# EAGLE design DUCO Miner 5D (EAGLE 9.6.2)
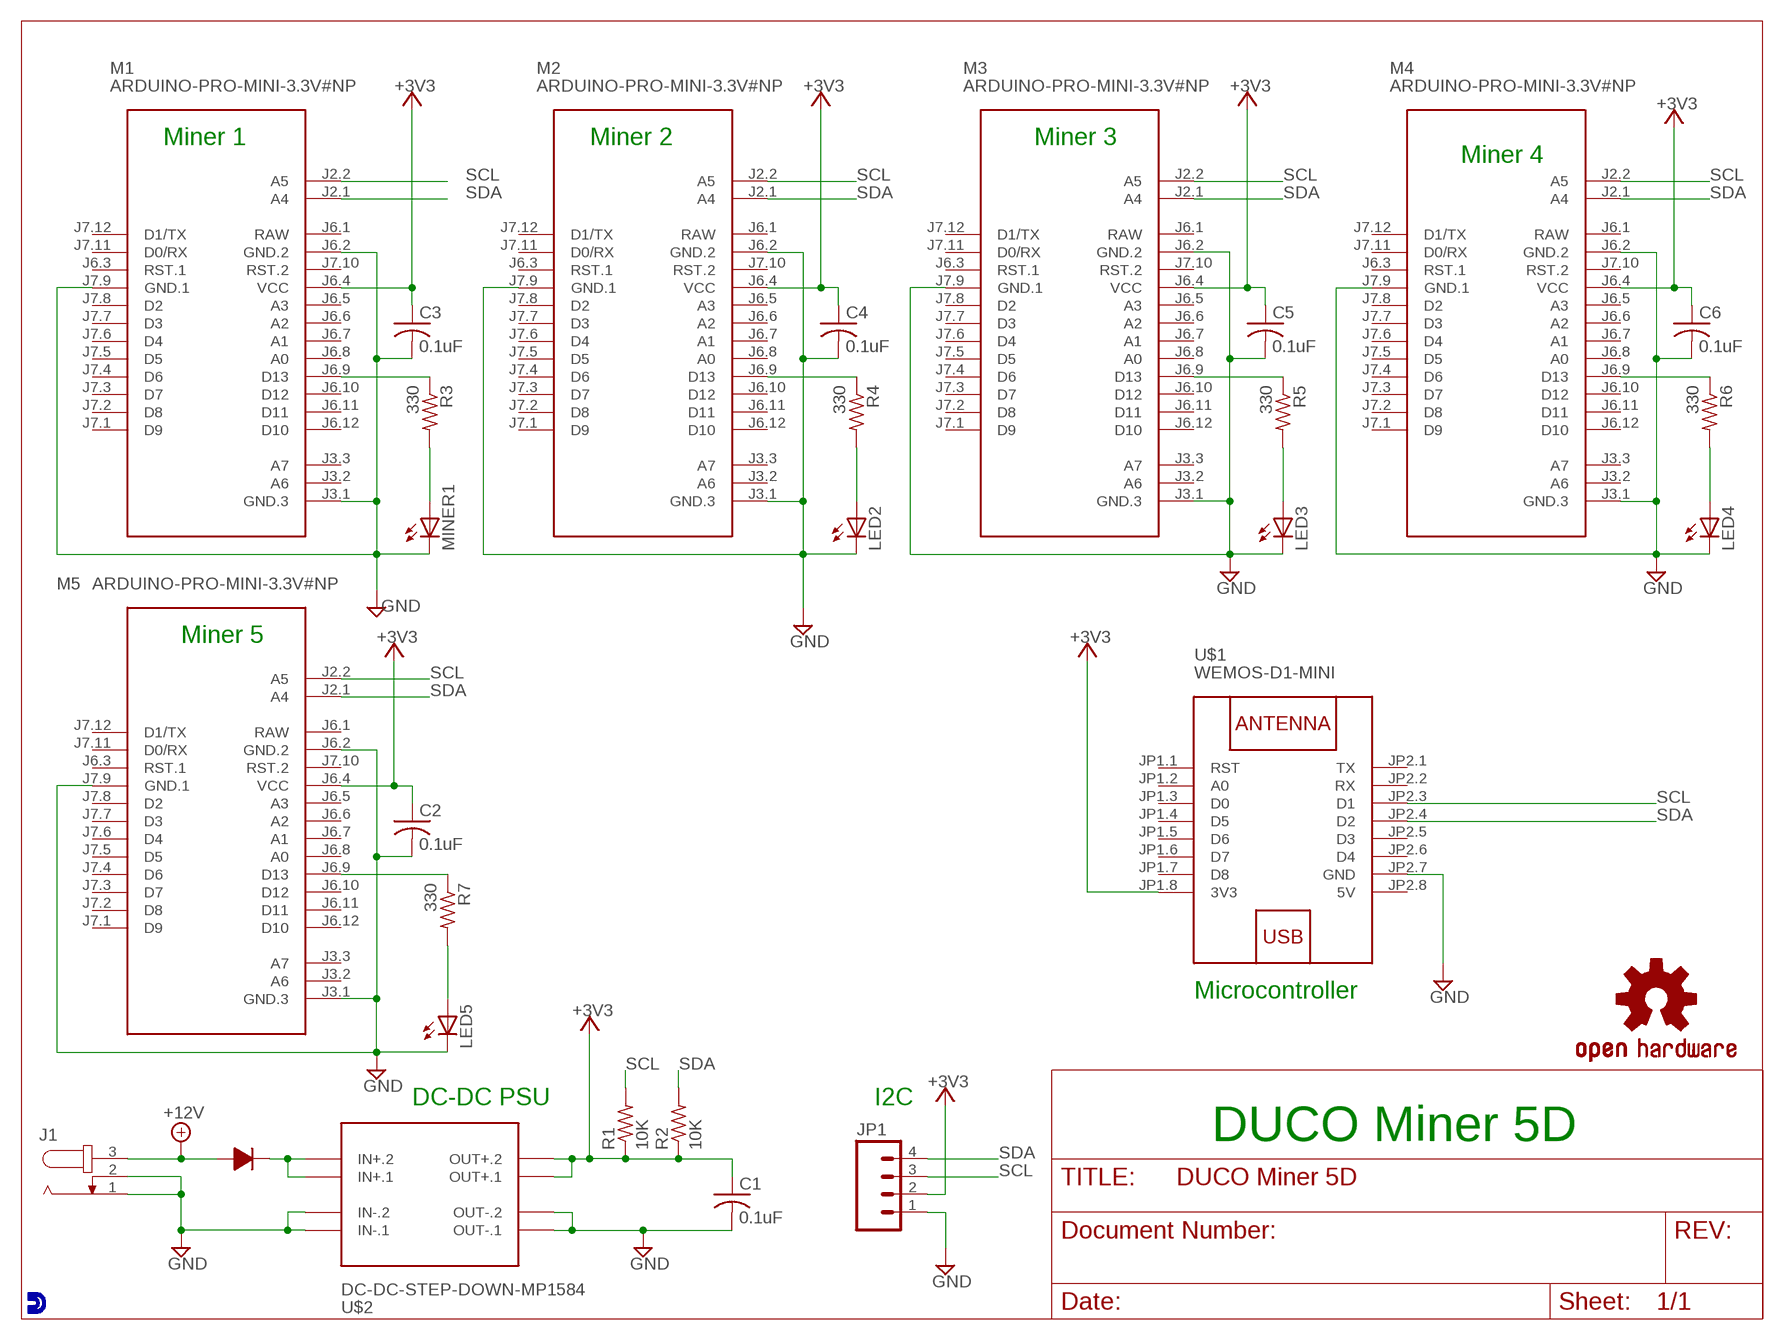
[diagram p0: schematic, sheet 1]

## Parts
C1  0.1uF  C-US025-025X050  [C025-025X050]
C2  0.1uF  C-US025-025X050  [C025-025X050]
C3  0.1uF  C-US025-025X050  [C025-025X050]
C4  0.1uF  C-US025-025X050  [C025-025X050]
C5  0.1uF  C-US025-025X050  [C025-025X050]
C6  0.1uF  C-US025-025X050  [C025-025X050]
J1  JACK-PLUG1  [SPC4078]
JP1  M04PTH  [1X04]
LED2  LED3MM  [LED3MM]
LED3  LED3MM  [LED3MM]
LED4  LED3MM  [LED3MM]
LED5  LED3MM  [LED3MM]
LOGO1  OSHW-LOGOS  [OSHW-LOGO-S]
M1  ARDUINO-PRO-MINI-3.3V#NP  [ARDUINO-PRO-MINI#NP]
M2  ARDUINO-PRO-MINI-3.3V#NP  [ARDUINO-PRO-MINI#NP]
M3  ARDUINO-PRO-MINI-3.3V#NP  [ARDUINO-PRO-MINI#NP]
M4  ARDUINO-PRO-MINI-3.3V#NP  [ARDUINO-PRO-MINI#NP]
M5  ARDUINO-PRO-MINI-3.3V#NP  [ARDUINO-PRO-MINI#NP]
MINER1  LED3MM  [LED3MM]
R1  10K  R-US_0204/7  [0204/7]
R2  10K  R-US_0204/7  [0204/7]
R3  330  R-US_0204/7  [0204/7]
R4  330  R-US_0204/7  [0204/7]
R5  330  R-US_0204/7  [0204/7]
R6  330  R-US_0204/7  [0204/7]
R7  330  R-US_0204/7  [0204/7]
U$1  WEMOS-D1-MINI  [WEMOS-D1-MINI]
U$2  DC-DC-STEP-DOWN-MP1584  [DC-DC-STEP-DOWN-MP1584]
U$4  1N4001  [DIODE-12.70]

## Nets
+3V3: C1.1 C2.1 C3.1 C4.1 C5.1 C6.1 JP1.2 M1.J6.4(VCC) M2.J6.4(VCC) M3.J6.4(VCC) M4.J6.4(VCC) M5.J6.4(VCC) R1.1 R2.1 U$1.JP1.8(3V3) U$2.OUT+.1 U$2.OUT+.2
+12V: J1.3 U$4.P$1
GND: C1.2 C2.2 C3.2 C4.2 C5.2 C6.2 J1.1 J1.2 JP1.1 LED2.K(C) LED3.K(C) LED4.K(C) LED5.K(C) M1.J3.1(GND.3) M1.J6.2(GND.2) M1.J7.9(GND.1) M2.J3.1(GND.3) M2.J6.2(GND.2) M2.J7.9(GND.1) M3.J3.1(GND.3) M3.J6.2(GND.2) M3.J7.9(GND.1) M4.J3.1(GND.3) M4.J6.2(GND.2) M4.J7.9(GND.1) M5.J3.1(GND.3) M5.J6.2(GND.2) M5.J7.9(GND.1) MINER1.K(C) U$1.JP2.7(GND) U$2.IN-.1 U$2.IN-.2 U$2.OUT-.1 U$2.OUT-.2
N$2: U$2.IN+.1 U$2.IN+.2 U$4.P$2
N$3: M1.J6.9(D13) R3.1
N$4: MINER1.A R3.2
N$5: M2.J6.9(D13) R4.1
N$6: LED2.A R4.2
N$7: M3.J6.9(D13) R5.1
N$8: LED3.A R5.2
N$9: M4.J6.9(D13) R6.1
N$10: LED4.A R6.2
N$11: M5.J6.9(D13) R7.1
N$13: LED5.A R7.2
SCL: JP1.3 M1.J2.2(A5) M2.J2.2(A5) M3.J2.2(A5) M4.J2.2(A5) M5.J2.2(A5) R1.2 U$1.JP2.3(D1)
SDA: JP1.4 M1.J2.1(A4) M2.J2.1(A4) M3.J2.1(A4) M4.J2.1(A4) M5.J2.1(A4) R2.2 U$1.JP2.4(D2)
Unconnected: M1.J3.2(A6) M1.J3.3(A7) M1.J6.3(RST.1) M1.J6.5(A3) M1.J6.6(A2) M1.J6.7(A1) M1.J6.8(A0) M1.J6.10(D12) M1.J6.11(D11) M1.J6.12(D10) M1.J7.1(D9) M1.J7.2(D8) M1.J7.3(D7) M1.J7.4(D6) M1.J7.5(D5) M1.J7.6(D4) M1.J7.7(D3) M1.J7.8(D2) M1.J7.10(RST.2) M1.J7.11(D0/RX) M1.J7.12(D1/TX) M2.J3.2(A6) M2.J3.3(A7) M2.J6.3(RST.1) M2.J6.5(A3) M2.J6.6(A2) M2.J6.7(A1) M2.J6.8(A0) M2.J6.10(D12) M2.J6.11(D11) M2.J6.12(D10) M2.J7.1(D9) M2.J7.2(D8) M2.J7.3(D7) M2.J7.4(D6) M2.J7.5(D5) M2.J7.6(D4) M2.J7.7(D3) M2.J7.8(D2) M2.J7.10(RST.2) M2.J7.11(D0/RX) M2.J7.12(D1/TX) M3.J3.2(A6) M3.J3.3(A7) M3.J6.3(RST.1) M3.J6.5(A3) M3.J6.6(A2) M3.J6.7(A1) M3.J6.8(A0) M3.J6.10(D12) M3.J6.11(D11) M3.J6.12(D10) M3.J7.1(D9) M3.J7.2(D8) M3.J7.3(D7) M3.J7.4(D6) M3.J7.5(D5) M3.J7.6(D4) M3.J7.7(D3) M3.J7.8(D2) M3.J7.10(RST.2) M3.J7.11(D0/RX) M3.J7.12(D1/TX) M4.J3.2(A6) M4.J3.3(A7) M4.J6.3(RST.1) M4.J6.5(A3) M4.J6.6(A2) M4.J6.7(A1) M4.J6.8(A0) M4.J6.10(D12) M4.J6.11(D11) M4.J6.12(D10) M4.J7.1(D9) M4.J7.2(D8) M4.J7.3(D7) M4.J7.4(D6) M4.J7.5(D5) M4.J7.6(D4) M4.J7.7(D3) M4.J7.8(D2) M4.J7.10(RST.2) M4.J7.11(D0/RX) M4.J7.12(D1/TX) M5.J3.2(A6) M5.J3.3(A7) M5.J6.3(RST.1) M5.J6.5(A3) M5.J6.6(A2) M5.J6.7(A1) M5.J6.8(A0) M5.J6.10(D12) M5.J6.11(D11) M5.J6.12(D10) M5.J7.1(D9) M5.J7.2(D8) M5.J7.3(D7) M5.J7.4(D6) M5.J7.5(D5) M5.J7.6(D4) M5.J7.7(D3) M5.J7.8(D2) M5.J7.10(RST.2) M5.J7.11(D0/RX) M5.J7.12(D1/TX) U$1.JP1.1(RST) U$1.JP1.2(A0) U$1.JP1.3(D0) U$1.JP1.4(D5) U$1.JP1.5(D6) U$1.JP1.6(D7) U$1.JP1.7(D8) U$1.JP2.1(TX) U$1.JP2.2(RX) U$1.JP2.5(D3) U$1.JP2.6(D4)

## Notes on the sheet
- Miner 1 | Miner 2 | Miner 3
- Miner 4
- Miner 5
- Microcontroller
- DC-DC PSU | I2C
- DUCO Miner 5D
- /home/g7ltt/Filestore/circuits/Duino Coin Miner/duino coin logo.bmp

## Power pins joined to a net without a drawn wire
5V: U$1.JP2.8(5V)
RAW: M1.J6.1(RAW) M2.J6.1(RAW) M3.J6.1(RAW) M4.J6.1(RAW) M5.J6.1(RAW)

## Library data of the parts
C1-C6 = rcl:C-US: CAPACITOR, American symbol; SPICEPREFIX: C
J1 = con-jack:JACK-PLUG: DC POWER JACK Power Jack, DC, Right Angle, Through Hole, Rated 5A at 16VDC, PC Terminals Distributor: Farnell (www.Farnell.de) Drawing: 84N1161.pdf / 84N1162.pdf Manufacturer: SPC Technology (www.spctechnology.com) Type: SPC4077 / SPC 4078; OC_FARNELL: unknown; OC_NEWARK: unknown
JP1 = SparkFun:M04: Header 4 Standard 4-pin 0.1" header. Use with straight break away headers (SKU : PRT-00116), right angle break away headers (PRT-00553), swiss pins (PRT-00743), machine pins (PRT-00117), and female headers (PRT-00115). Molex polarized connector foot print use with SKU : PRT-08231 with associated crimp pins and housings. 1MM SMD Version SKU: PRT-10208
LED2-LED5 MINER1 = led:LED: LED OSRAM: - CHIPLED LG R971, LG N971, LY N971, LG Q971, LY Q971, LO R971, LY R971 LH N974, LH R974 LS Q976, LO Q976, LY Q976 LO Q996 - Hyper CHIPLED LW Q18S LB Q993, LB Q99A, LB R99A - SideLED LS A670, LO A670, LY A670, LG A670, LP A670 LB A673, LV A673, LT A673, LW A673 LH A674 LY A675 LS A676, LA A676, LO A676, LY A676, LW A676 LS A679, LY A679, LG A679 - Hyper Micro SIDELED® LS Y876, LA Y876, LO Y876, LY Y876 LT Y87S - SmartLED LW L88C, LW L88S LB L89C, LB L89S, LG L890 LS L89K, LO L89K, LY L89K LS L896, LA L896, LO L896, LY L896 - TOPLED LS T670, LO T670, LY T670, LG T670, LP T670 LSG T670, LSP T670, LSY T670, LOP T670, LYG T670 LG T671, LOG T671, LSG T671 LB T673, LV T673, LT T673, LW T673 LH T674 LS T676, LA T676, LO T676, LY T676, LB T676, LH T676, LSB T676, LW T676 LB T67C, LV T67C, LT T67C, LS T67K, LO T67K, LY T67K, LW E67C LS E67B, LA E67B, LO E67B, LY E67B, LB E67C, LV E67C, LT E67C LW T67C LS T679, LY T679, LG T679 LS T770, LO T770, LY T770, LG T770, LP T770 LB T773, LV T773, LT T773, LW T773 LH T774 LS E675, LA E675, LY E675, LS T675 LS T776, LA T776, LO T776, LY T776, LB T776 LHGB T686 LT T68C, LB T68C - Hyper Mini TOPLED® LB M676 - Mini TOPLED Santana® LG M470 LS M47K, LO M47K, LY M47K Source: http://www.osram.convergy.de LUXEON: - LUMILED® LXK2-PW12-R00, LXK2-PW12-S00, LXK2-PW14-U00, LXK2-PW14-V00 LXK2-PM12-R00, LXK2-PM12-S00, LXK2-PM14-U00 LXK2-PE12-Q00, LXK2-PE12-R00, LXK2-PE12-S00, LXK2-PE14-T00, LXK2-PE14-U00 LXK2-PB12-K00, LXK2-PB12-L00, LXK2-PB12-M00, LXK2-PB14-N00, LXK2-PB14-P00, LXK2-PB14-Q00 LXK2-PR12-L00, LXK2-PR12-M00, LXK2-PR14-Q00, LXK2-PR14-R00 LXK2-PD12-Q00, LXK2-PD12-R00, LXK2-PD12-S00 LXK2-PH12-R00, LXK2-PH12-S00 LXK2-PL12-P00, LXK2-PL12-Q00, LXK2-PL12-R00 Source: www.luxeon.com KINGBRIGHT: KA-3528ASYC Source: www.kingbright.com
LOGO1 = SparkFun-Aesthetics:OSHW-LOGO: Open Source Hardware Logo This logo indicates the piece of hardware it is found on incorporates a OSHW license and/or adheres to the definition of open source hardware found here: http://freedomdefined.org/OSHW
M1-M5 = diy-modules:ARDUINO-PRO-MINI-*#NP: Arduino Pro Mini (and compatible devices) without programming pads More details available here: https://www.arduino.cc/en/Main/ArduinoBoardProMini Click here to find device on ebay.com <http://www.ebay.com/sch/arduino+pro+mini>
R1-R7 = rcl:R-US_: RESISTOR, American symbol; SPICEPREFIX: R
U$1 = diy-modules:WEMOS-D1-MINI: WEMOS D1 mini: Mini Wi-Fi Board based on ESP-8266 device More details can be found here: https://www.wemos.cc/product/d1-mini.html Click here to find device on ebay.com <http://www.ebay.com/sch/wemos+d1+mini+nodemcu>
U$2 = diy-modules:DC-DC-STEP-DOWN-MP1584: DC/DC Step-Down Regulator based on MP1584 chip MP1584 datasheet available here: http://www.haoyuelectronics.com/Attachment/MP1584/MP1584.pdf Click here to find device on ebay.com <http://www.ebay.com/sch/mp1584+module>
U$4 = Oles komponentbibliotek:1N4001: 1N4001 diode

## Board
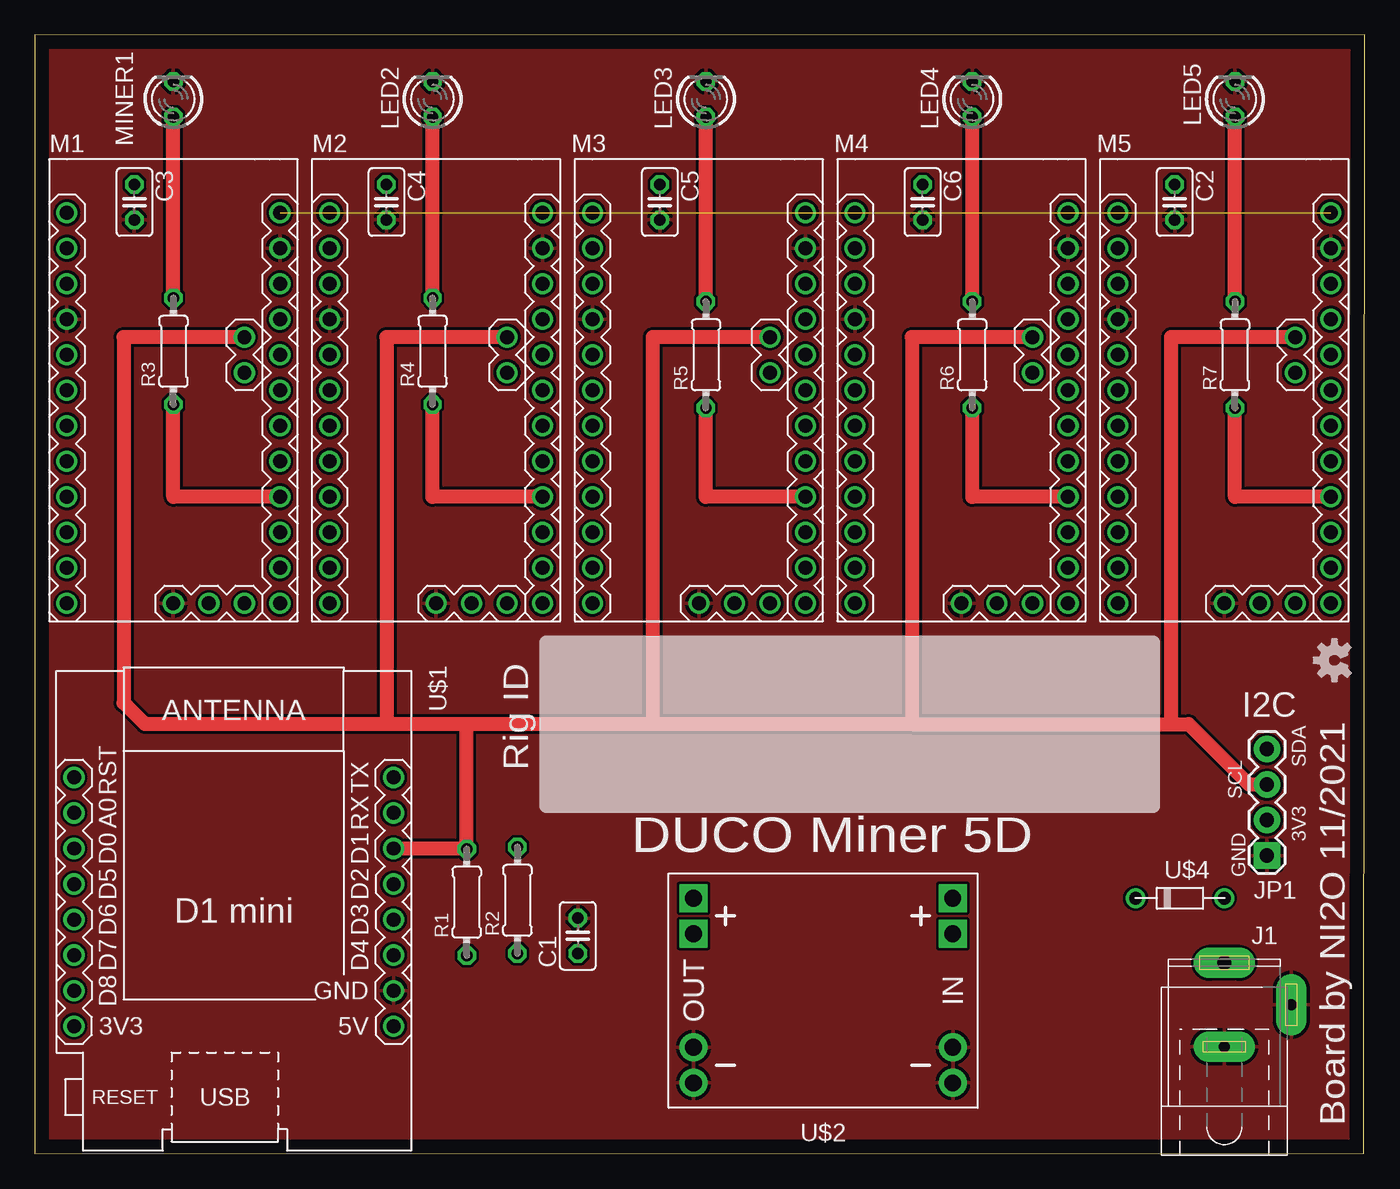
[diagram p1: board, top side]
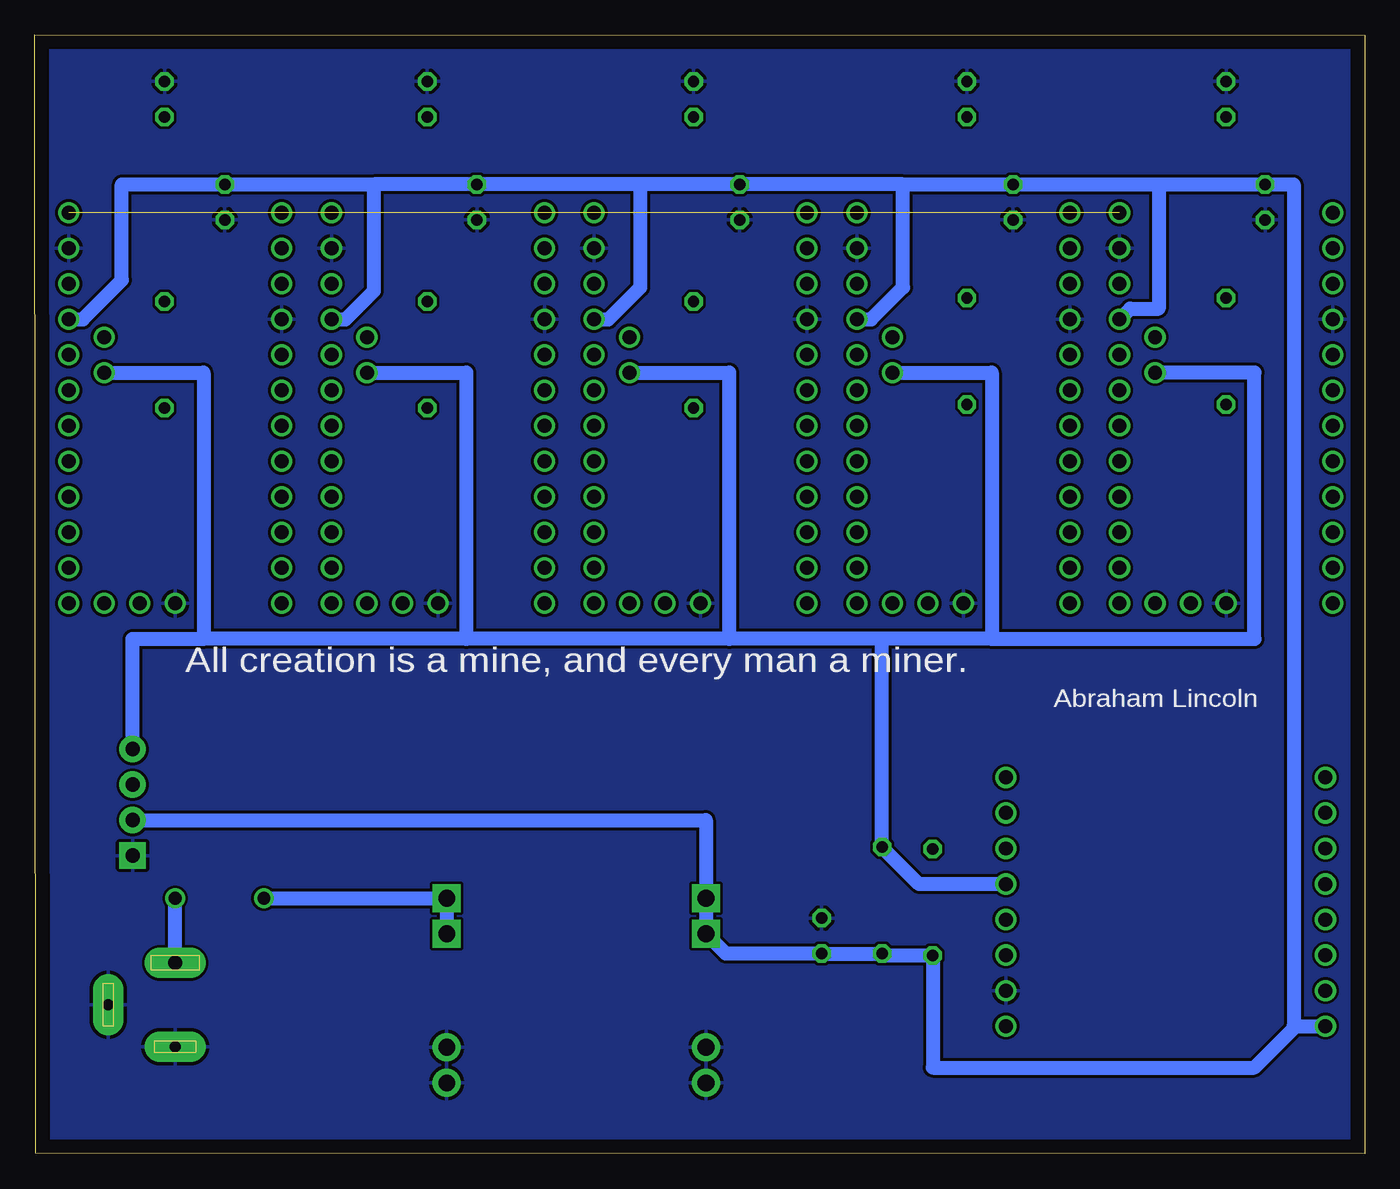
[diagram p2: board, bottom side, seen from below]

Size 95.12 x 80.03 mm. Coordinates in mm from the lower left corner, seen from the top.
Outline: 0,0 95.07,0.05 95.12,80.03 0,80 0,0
Copper layers (1*16): Top 0.035mm / dielectric 1.5mm / Bottom 0.035mm
Design rules "default": minimum track width 10mil, minimum drill 24mil, track to track 8mil, track to pad 8mil, pad to pad 8mil, via to via 8mil, smd to smd 8mil, copper to edge 40mil, drill to drill 8mil, minimum pad ring 10mil, minimum via ring 8mil, stop-mask expansion 4mil, vias tented up to drill 0mil, thermal gap 10mil

### Footprints (pad centres in the part's own frame; a part is rotated, then mirrored left to right if it is on the bottom)
C025-025X050 = drill 0.813 octagon: 1 -1.27,0; 2 1.27,0
SPC4078 = drill 0.8 pad 2.184 long: 1 -3,0; 2 0,-4.8 | drill 1 pad 2.184 long: 3 3,0
1X04 = drill 1.016 pad 1.88 square: 1 0,0 | drill 1.016 pad 1.88: 2 2.54,0; 3 5.08,0; 4 7.62,0
LED3MM = drill 0.813 octagon: A -1.27,0; K 1.27,0
ARDUINO-PRO-MINI#NP = drill 1: J2.1 -1.27,5.08; J2.2 -3.81,5.08; J3.1 15.24,0; J3.2 15.24,2.54; J3.3 15.24,5.08; J6.1 -12.7,7.62; J6.2 -10.16,7.62; J6.3 -7.62,7.62; J6.4 -5.08,7.62; J6.5 -2.54,7.62; J6.6 0,7.62; J6.7 2.54,7.62; J6.8 5.08,7.62; J6.9 7.62,7.62; J6.10 10.16,7.62; J6.11 12.7,7.62; J6.12 15.24,7.62; J7.1 15.24,-7.62; J7.2 12.7,-7.62; J7.3 10.16,-7.62; J7.4 7.62,-7.62; J7.5 5.08,-7.62; J7.6 2.54,-7.62; J7.7 0,-7.62; J7.8 -2.54,-7.62; J7.9 -5.08,-7.62; J7.10 -7.62,-7.62; J7.11 -10.16,-7.62; J7.12 -12.7,-7.62
0204/7 = drill 0.813 octagon: 1 -3.81,0; 2 3.81,0
WEMOS-D1-MINI = drill 1: JP1.1 -11.43,9.525; JP1.2 -11.43,6.985; JP1.3 -11.43,4.445; JP1.4 -11.43,1.905; JP1.5 -11.43,-0.635; JP1.6 -11.43,-3.175; JP1.7 -11.43,-5.715; JP1.8 -11.43,-8.255; JP2.1 11.43,9.525; JP2.2 11.43,6.985; JP2.3 11.43,4.445; JP2.4 11.43,1.905; JP2.5 11.43,-0.635; JP2.6 11.43,-3.175; JP2.7 11.43,-5.715; JP2.8 11.43,-8.255
DC-DC-STEP-DOWN-MP1584 = drill 1.2 pad 2 square: IN+.1 -9.271,-4.064; IN+.2 -9.271,-6.604; OUT+.1 9.271,-4.064; OUT+.2 9.271,-6.604 | drill 1.2 pad 2: IN-.1 -9.271,6.604; IN-.2 -9.271,4.064; OUT-.1 9.271,6.604; OUT-.2 9.271,4.064
DIODE-12.70 = drill 0.9: P$1 -3.81,0; P$2 2.54,0

### Placement (x,y rotation side)
C1  38.84,15.6 90 top
C2  81.53,68.07 270 top
C3  7.11,68.07 270 top
C4  25.15,68.07 270 top
C5  44.7,68.07 270 top
C6  63.5,68.07 270 top
J1  85.09,10.67 90 top
JP1  88.14,21.34 90 top
LED2  28.45,75.44 90 top
LED3  48.01,75.44 90 top
LED4  67.06,75.44 90 top
LED5  85.85,75.44 90 top
LOGO1  92.96,35.31 90 top
M1  9.91,54.61 270 top
M2  28.7,54.61 270 top
M3  47.5,54.61 270 top
M4  66.29,54.61 270 top
M5  85.09,54.61 270 top
MINER1  9.91,75.44 90 top
R1  30.89,18.01 90 top
R2  34.52,18.14 90 top
R3  9.91,57.4 90 top
R4  28.45,57.4 90 top
R5  48.01,57.15 90 top
R6  67.06,57.15 90 top
R7  85.85,57.15 90 top
U$1  14.22,17.4 0 top
U$2  56.39,11.68 180 top
U$4  81.28,18.29 180 top

### Tracks (layer width: path | path; a pad name or v marks a point on that pad's centre or on a via)
+3V3
  Bottom 1.016: M1.J6.4 16.76,60.45 14.73,60.45 14.73,69.34 | 14.73,69.34 C3.1 5.08,69.34 5.08,9.14 U$1.JP1.8 4.93,9.14 7.9,6.17 30.89,6.17 R1.1 34.39,14.2 R2.1 C1.1 45.7,14.33 U$2.OUT+.1 U$2.OUT+.2 47.12,23.88 JP1.2 | 33.02,69.34 C4.1 14.73,69.34 | 33.02,69.34 C5.1 51.82,69.34 | 51.82,69.34 C6.1 70.87,69.34 | 70.87,69.34 C2.1 88.9,69.34 88.9,62.48 91.69,59.69 M5.J6.4 | M2.J6.4 35.31,59.69 33.02,61.98 33.02,69.34 | M3.J6.4 54.1,59.69 51.82,61.98 51.82,69.34 | M4.J6.4 72.9,59.69 70.87,61.72 70.87,69.34
+12V
  Bottom 1.016: J1.3 U$4.P$1
GND
  pour Top: 95.15,0.04 95.15,80.04 0,80.04 0,0.3
  pour Bottom: 0,0.08 0,80.01 95.1,80.01 95.1,0.08
N$2
  Bottom 1.016: U$4.P$2 U$2.IN+.2 U$2.IN+.1
N$3
  Top 1.016: M1.J6.9 9.91,46.99 R3.1
N$4
  Top 1.016: R3.2 MINER1.A
N$5
  Top 1.016: M2.J6.9 28.45,46.99 R4.1
N$6
  Top 1.016: R4.2 LED2.A
N$7
  Top 1.016: M3.J6.9 48.01,46.99 R5.1
N$8
  Top 1.016: R5.2 LED3.A
N$9
  Top 1.016: M4.J6.9 67.06,46.99 R6.1
N$10
  Top 1.016: R6.2 LED4.A
N$11
  Top 1.016: M5.J6.9 85.85,46.99 R7.1
N$13
  Top 1.016: R7.2 LED5.A
RAW  (4 unrouted)
SCL
  Top 1.016: M1.J2.2 6.35,58.42 6.35,32.26 7.87,30.73 25.15,30.73 | M2.J2.2 25.15,58.42 25.15,30.73 | 30.99,30.73 30.98,30.73 | M3.J2.2 44.2,58.42 44.2,30.73 | 44.2,30.73 30.99,30.73 | 30.99,30.73 30.89,30.73 | 30.89,30.73 25.15,30.73 | M4.J2.2 62.74,58.42 62.74,30.73 | 62.74,30.73 44.2,30.73 | M5.J2.2 81.28,58.42 81.28,30.73 | JP1.3 86.87,26.42 82.55,30.73 81.28,30.73 | 62.74,30.73 81.28,30.73 | 30.89,30.73 R1.2 30.86,21.84 U$1.JP2.3
SDA
  Bottom 1.016: U$1.JP2.4 31.88,19.3 R2.2 34.52,36.83 | M1.J2.1 7.87,55.88 7.87,36.83 26.67,36.83 | M2.J2.1 26.67,55.88 26.67,36.83 | M3.J2.1 45.47,55.88 45.47,36.83 | M4.J2.1 64.26,55.88 64.26,36.83 | M5.J2.1 83.06,55.88 83.06,36.83 | JP1.4 88.14,36.83 83.06,36.83 | 26.67,36.83 34.52,36.83 | 34.52,36.83 45.47,36.83 | 45.47,36.83 64.26,36.83 | 64.26,36.83 83.06,36.83

### Text on the board
tNames: I2C | SDA | Rig ID | SCL | DUCO Miner 5D | 3V3 | GND | Board by NI2O 11/2021
bNames: All creation is a mine, and every man a miner. | Abraham Lincoln
201bmp: /home/g7ltt/Filestore/circuits/Duino Coin Miner/duino coin logo.bmp